# Altium schematic sheet MODULES.SchDoc
size A4; SheetNumber: 3; SheetTotal: 7
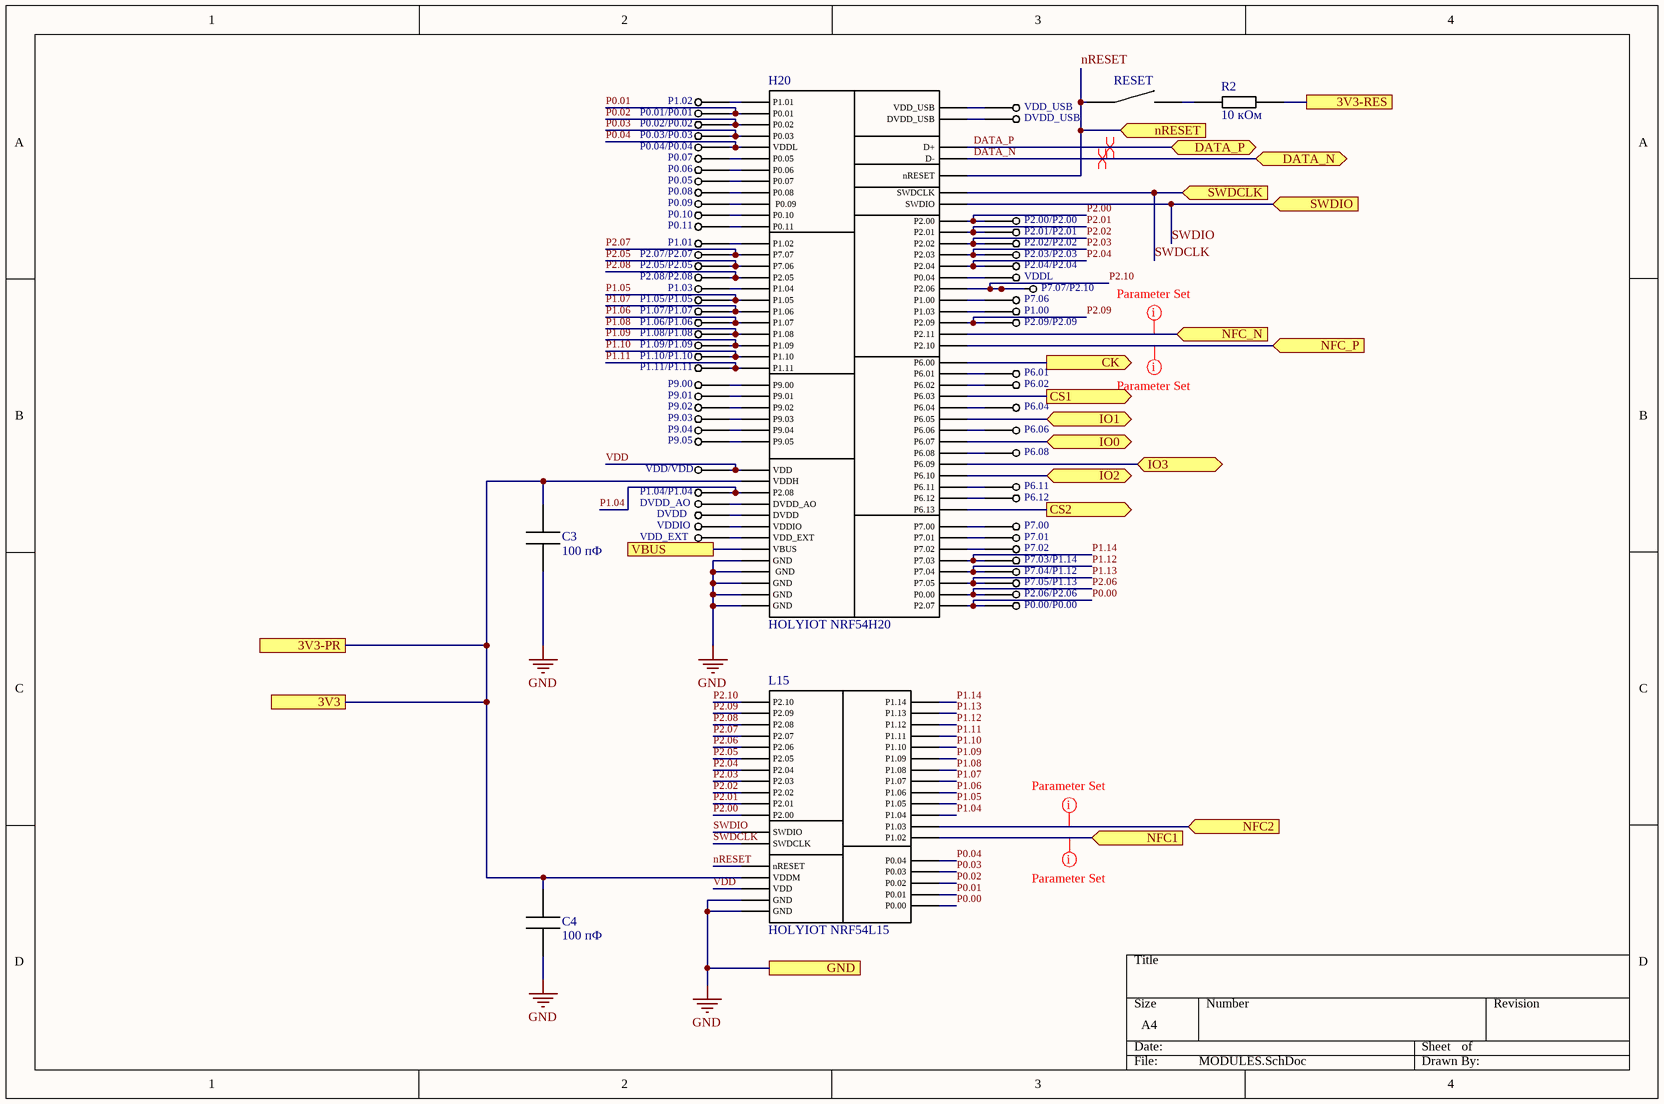
[diagram p0: MODULES.SchDoc]

## Parts
C3  100 пФ  [Murata GRM2165C1H101J]
C4  100 пФ  [Murata GRM2165C1H101J]
DVDD  PLS-1 (Ningbo Xinlaiya)  [PLS-1]  (value not drawn)
DVDD_AO  PLS-1 (Ningbo Xinlaiya)  [PLS-1]  (value not drawn)
DVDD_USB  PLS-1 (Ningbo Xinlaiya)  [PLS-1]  (value not drawn)
H20  HOLYIOT NRF54H20  [HOLYIOT NRF54H20]
L15  HOLYIOT NRF54L15  [HOLYIOT NRF54L15]
P0.00/P0.00  PLS-1 (Ningbo Xinlaiya)  [PLS-1]  (value not drawn)
P0.01/P0.01  PLS-1 (Ningbo Xinlaiya)  [PLS-1]  (value not drawn)
P0.02/P0.02  PLS-1 (Ningbo Xinlaiya)  [PLS-1]  (value not drawn)
P0.03/P0.03  PLS-1 (Ningbo Xinlaiya)  [PLS-1]  (value not drawn)
P0.04/P0.04  PLS-1 (Ningbo Xinlaiya)  [PLS-1]  (value not drawn)
P0.05  PLS-1 (Ningbo Xinlaiya)  [PLS-1]  (value not drawn)
P0.06  PLS-1 (Ningbo Xinlaiya)  [PLS-1]  (value not drawn)
P0.07  PLS-1 (Ningbo Xinlaiya)  [PLS-1]  (value not drawn)
P0.08  PLS-1 (Ningbo Xinlaiya)  [PLS-1]  (value not drawn)
P0.09  PLS-1 (Ningbo Xinlaiya)  [PLS-1]  (value not drawn)
P0.10  PLS-1 (Ningbo Xinlaiya)  [PLS-1]  (value not drawn)
P0.11  PLS-1 (Ningbo Xinlaiya)  [PLS-1]  (value not drawn)
P1.00  PLS-1 (Ningbo Xinlaiya)  [PLS-1]  (value not drawn)
P1.01  PLS-1 (Ningbo Xinlaiya)  [PLS-1]  (value not drawn)
P1.02  PLS-1 (Ningbo Xinlaiya)  [PLS-1]  (value not drawn)
P1.03  PLS-1 (Ningbo Xinlaiya)  [PLS-1]  (value not drawn)
P1.04/P1.04  PLS-1 (Ningbo Xinlaiya)  [PLS-1]  (value not drawn)
P1.05/P1.05  PLS-1 (Ningbo Xinlaiya)  [PLS-1]  (value not drawn)
P1.06/P1.06  PLS-1 (Ningbo Xinlaiya)  [PLS-1]  (value not drawn)
P1.07/P1.07  PLS-1 (Ningbo Xinlaiya)  [PLS-1]  (value not drawn)
P1.08/P1.08  PLS-1 (Ningbo Xinlaiya)  [PLS-1]  (value not drawn)
P1.09/P1.09  PLS-1 (Ningbo Xinlaiya)  [PLS-1]  (value not drawn)
P1.10/P1.10  PLS-1 (Ningbo Xinlaiya)  [PLS-1]  (value not drawn)
P1.11/P1.11  PLS-1 (Ningbo Xinlaiya)  [PLS-1]  (value not drawn)
P2.00/P2.00  PLS-1 (Ningbo Xinlaiya)  [PLS-1]  (value not drawn)
P2.01/P2.01  PLS-1 (Ningbo Xinlaiya)  [PLS-1]  (value not drawn)
P2.02/P2.02  PLS-1 (Ningbo Xinlaiya)  [PLS-1]  (value not drawn)
P2.03/P2.03  PLS-1 (Ningbo Xinlaiya)  [PLS-1]  (value not drawn)
P2.04/P2.04  PLS-1 (Ningbo Xinlaiya)  [PLS-1]  (value not drawn)
P2.05/P2.05  PLS-1 (Ningbo Xinlaiya)  [PLS-1]  (value not drawn)
P2.06/P2.06  PLS-1 (Ningbo Xinlaiya)  [PLS-1]  (value not drawn)
P2.07/P2.07  PLS-1 (Ningbo Xinlaiya)  [PLS-1]  (value not drawn)
P2.08/P2.08  PLS-1 (Ningbo Xinlaiya)  [PLS-1]  (value not drawn)
P2.09/P2.09  PLS-1 (Ningbo Xinlaiya)  [PLS-1]  (value not drawn)
P6.01  PLS-1 (Ningbo Xinlaiya)  [PLS-1]  (value not drawn)
P6.02  PLS-1 (Ningbo Xinlaiya)  [PLS-1]  (value not drawn)
P6.04  PLS-1 (Ningbo Xinlaiya)  [PLS-1]  (value not drawn)
P6.06  PLS-1 (Ningbo Xinlaiya)  [PLS-1]  (value not drawn)
P6.08  PLS-1 (Ningbo Xinlaiya)  [PLS-1]  (value not drawn)
P6.11  PLS-1 (Ningbo Xinlaiya)  [PLS-1]  (value not drawn)
P6.12  PLS-1 (Ningbo Xinlaiya)  [PLS-1]  (value not drawn)
P7.00  PLS-1 (Ningbo Xinlaiya)  [PLS-1]  (value not drawn)
P7.01  PLS-1 (Ningbo Xinlaiya)  [PLS-1]  (value not drawn)
P7.02  PLS-1 (Ningbo Xinlaiya)  [PLS-1]  (value not drawn)
P7.03/P1.14  PLS-1 (Ningbo Xinlaiya)  [PLS-1]  (value not drawn)
P7.04/P1.12  PLS-1 (Ningbo Xinlaiya)  [PLS-1]  (value not drawn)
P7.05/P1.13  PLS-1 (Ningbo Xinlaiya)  [PLS-1]  (value not drawn)
P7.06  PLS-1 (Ningbo Xinlaiya)  [PLS-1]  (value not drawn)
P7.07/P2.10  PLS-1 (Ningbo Xinlaiya)  [PLS-1]  (value not drawn)
P9.00  PLS-1 (Ningbo Xinlaiya)  [PLS-1]  (value not drawn)
P9.01  PLS-1 (Ningbo Xinlaiya)  [PLS-1]  (value not drawn)
P9.02  PLS-1 (Ningbo Xinlaiya)  [PLS-1]  (value not drawn)
P9.03  PLS-1 (Ningbo Xinlaiya)  [PLS-1]  (value not drawn)
P9.04  PLS-1 (Ningbo Xinlaiya)  [PLS-1]  (value not drawn)
P9.05  PLS-1 (Ningbo Xinlaiya)  [PLS-1]  (value not drawn)
R2  10 кОм  [Yageo RC0805JR-0710KL]
RESET  RES BUT  [RES BUT]  (value not drawn)
VDD/VDD  PLS-1 (Ningbo Xinlaiya)  [PLS-1]  (value not drawn)
VDD_EXT  PLS-1 (Ningbo Xinlaiya)  [PLS-1]  (value not drawn)
VDD_USB  PLS-1 (Ningbo Xinlaiya)  [PLS-1]  (value not drawn)
VDDIO  PLS-1 (Ningbo Xinlaiya)  [PLS-1]  (value not drawn)
VDDL  PLS-1 (Ningbo Xinlaiya)  [PLS-1]  (value not drawn)

## Ports
3V3 (see TOP_LEVEL[2A], POWER_IN[3B]), 3V3-PR (see TOP_LEVEL[3A], SWD[2B]), 3V3-RES (see TOP_LEVEL[2A], POWER_IN[3B]), CK (out, see TOP_LEVEL[2B], FLASH[1B]), CS1 (out, see TOP_LEVEL[2B], FLASH[1B]), CS2 (out, see TOP_LEVEL[2C], FLASH[2C]), DATA_N (bidir, see TOP_LEVEL[3C], USB[2B]), DATA_P (bidir, see TOP_LEVEL[3C], USB[2B]), GND (see TOP_LEVEL[2D], FLASH[3C], NFC[2C], POWER_IN[3C], SWD[2B], USB[2C]), IO0 (bidir, see TOP_LEVEL[2B], FLASH[1B]), IO1 (bidir, see TOP_LEVEL[2B], FLASH[1B]), IO2 (bidir, see TOP_LEVEL[2C], FLASH[1C]), IO3 (bidir, see TOP_LEVEL[2C], FLASH[1C]), NFC1 (in, see TOP_LEVEL[2C], NFC[1B]), NFC2 (in, see TOP_LEVEL[2D], NFC[1C]), NFC_N (in, see TOP_LEVEL[2C], NFC[1A]), NFC_P (in, see TOP_LEVEL[2C], NFC[1A]), nRESET (in, see TOP_LEVEL[3B], SWD[2B]), SWDCLK (in, see TOP_LEVEL[3A], SWD[2B]), SWDIO (in, see TOP_LEVEL[3B], SWD[2B]), VBUS (see TOP_LEVEL[3C], USB[2B])

## Nets
GND: C3.1 C4.1 H20.1(GND) H20.4(GND) H20.28(GND) H20.29(GND) H20.58(GND) L15.1(GND) L15.36(GND) ; port GND
3V3: C3.2 C4.2 H20.2(VDDH) L15.9(VDDM) ; port 3V3, port 3V3-PR
3V3-RES: R2.2 ; port 3V3-RES
CK: H20.15(P6.00) ; port CK
CS1: H20.18(P6.03) ; port CS1
CS2: H20.7(P6.13) ; port CS2
DATA_N: H20.78(D-) ; port DATA_N
DATA_P: H20.79(D+) ; port DATA_P
IO0: H20.13(P6.07) ; port IO0
IO1: H20.20(P6.05) ; port IO1
IO2: H20.10(P6.10) ; port IO2
IO3: H20.11(P6.09) ; port IO3
NFC1: L15.10(P1.02) ; port NFC1
NFC2: L15.11(P1.03) ; port NFC2
NFC_N: H20.26(P2.11) ; port NFC_N
NFC_P: H20.27(P2.10) ; port NFC_P
nRESET: H20.72(nRESET) L15.35(nRESET) RESET.1 ; port nRESET
P0.00: H20.32(P2.07) L15.28(P0.00) P0.00/P0.00.1
P0.01: H20.68(P0.01) L15.29(P0.01) P0.01/P0.01.1
P0.02: H20.67(P0.02) L15.32(P0.02) P0.02/P0.02.1
P0.03: H20.66(P0.03) L15.33(P0.03) P0.03/P0.03.1
P0.04: H20.55(VDDL) L15.34(P0.04) P0.04/P0.04.1
P1.04: H20.31(P2.08) L15.12(P1.04) P1.04/P1.04.1
P1.05: H20.84(P1.05) L15.13(P1.05) P1.05/P1.05.1
P1.06: H20.60(P1.07) L15.14(P1.06) P1.06/P1.06.1
P1.07: H20.59(P1.06) L15.15(P1.07) P1.07/P1.07.1
P1.08: H20.83(P1.08) L15.16(P1.08) P1.08/P1.08.1
P1.09: H20.61(P1.09) L15.2(P1.09) P1.09/P1.09.1
P1.10: H20.81(P1.10) L15.3(P1.10) P1.10/P1.10.1
P1.11: H20.82(P1.11) L15.5(P1.11) P1.11/P1.11.1
P1.12: H20.38(P7.04) L15.6(P1.12) P7.04/P1.12.1
P1.13: H20.37(P7.05) L15.7(P1.13) P7.05/P1.13.1
P1.14: H20.39(P7.03) L15.8(P1.14) P7.03/P1.14.1
P2.00: H20.21(P2.00) L15.17(P2.00) P2.00/P2.00.1
P2.01: H20.22(P2.01) L15.18(P2.01) P2.01/P2.01.1
P2.02: H20.23(P2.02) L15.19(P2.02) P2.02/P2.02.1
P2.03: H20.24(P2.03) L15.20(P2.03) P2.03/P2.03.1
P2.04: H20.25(P2.04) L15.21(P2.04) P2.04/P2.04.1
P2.05: H20.36(P7.06) L15.22(P2.05) P2.05/P2.05.1
P2.06: H20.50(P0.00) L15.23(P2.06) P2.06/P2.06.1
P2.07: H20.35(P7.07) L15.24(P2.07) P2.07/P2.07.1
P2.08: H20.34(P2.05) L15.25(P2.08) P2.08/P2.08.1
P2.09: H20.30(P2.09) L15.26(P2.09) P2.09/P2.09.1
P2.10: H20.33(P2.06) L15.27(P2.10) P7.07/P2.10.1
SWDCLK: H20.74(SWDCLK) L15.30(SWDCLK) ; port SWDCLK
SWDIO: H20.73(SWDIO) L15.31(SWDIO) ; port SWDIO
VBUS: H20.77(VBUS) ; port VBUS
VDD: H20.3(VDD) L15.4(VDD) VDD/VDD.1
NetDVDD_1: DVDD.1 H20.5(DVDD)
NetDVDD_AO_1: DVDD_AO.1 H20.6(DVDD_AO)
NetDVDD_USB_1: DVDD_USB.1 H20.76(DVDD_USB)
NetH20_8: H20.8(P6.12) P6.12.1
NetH20_9: H20.9(P6.11) P6.11.1
NetH20_12: H20.12(P6.08) P6.08.1
NetH20_14: H20.14(P6.06) P6.06.1
NetH20_16: H20.16(P6.01) P6.01.1
NetH20_17: H20.17(P6.02) P6.02.1
NetH20_19: H20.19(P6.04) P6.04.1
NetH20_40: H20.40(P7.02) P7.02.1
NetH20_41: H20.41(P7.01) P7.01.1
NetH20_42: H20.42(P7.00) P7.00.1
NetH20_43: H20.43(P0.09) P0.09.1
NetH20_44: H20.44(P0.08) P0.08.1
NetH20_45: H20.45(P0.05) P0.07.1
NetH20_46: H20.46(P0.06) P0.06.1
NetH20_47: H20.47(P0.07) P0.05.1
NetH20_48: H20.48(P9.00) P9.00.1
NetH20_49: H20.49(P9.01) P9.01.1
NetH20_51: H20.51(P0.04) VDDL.1
NetH20_52: H20.52(P1.04) P1.03.1
NetH20_53: H20.53(P1.03) P1.00.1
NetH20_54: H20.54(P1.02) P1.01.1
NetH20_56: H20.56(P1.01) P1.02.1
NetH20_57: H20.57(P1.00) P7.06.1
NetH20_62: H20.62(P9.05) P9.05.1
NetH20_63: H20.63(P9.04) P9.04.1
NetH20_64: H20.64(P9.03) P9.03.1
NetH20_65: H20.65(P9.02) P9.02.1
NetH20_69: H20.69(P0.10) P0.10.1
NetH20_70: H20.70(P0.11) P0.11.1
NetH20_71: H20.71(VDDIO) VDDIO.1
NetH20_75: H20.75(VDD_EXT) VDD_EXT.1
NetH20_80: H20.80(VDD_USB) VDD_USB.1
NetR2_1: R2.1 RESET.2

## Layout directives
differential pair; differential pair class USB: DATA_N, DATA_P
Parameter 1: 50 Ом: NFC1, NFC2, NFC_N, NFC_P

## Library data of the parts
C3 C4 = Murata GRM2165C1H101J
R2 = Yageo RC0805JR-0710KL